# EAGLE design raspitreiber (EAGLE 9.6.2)
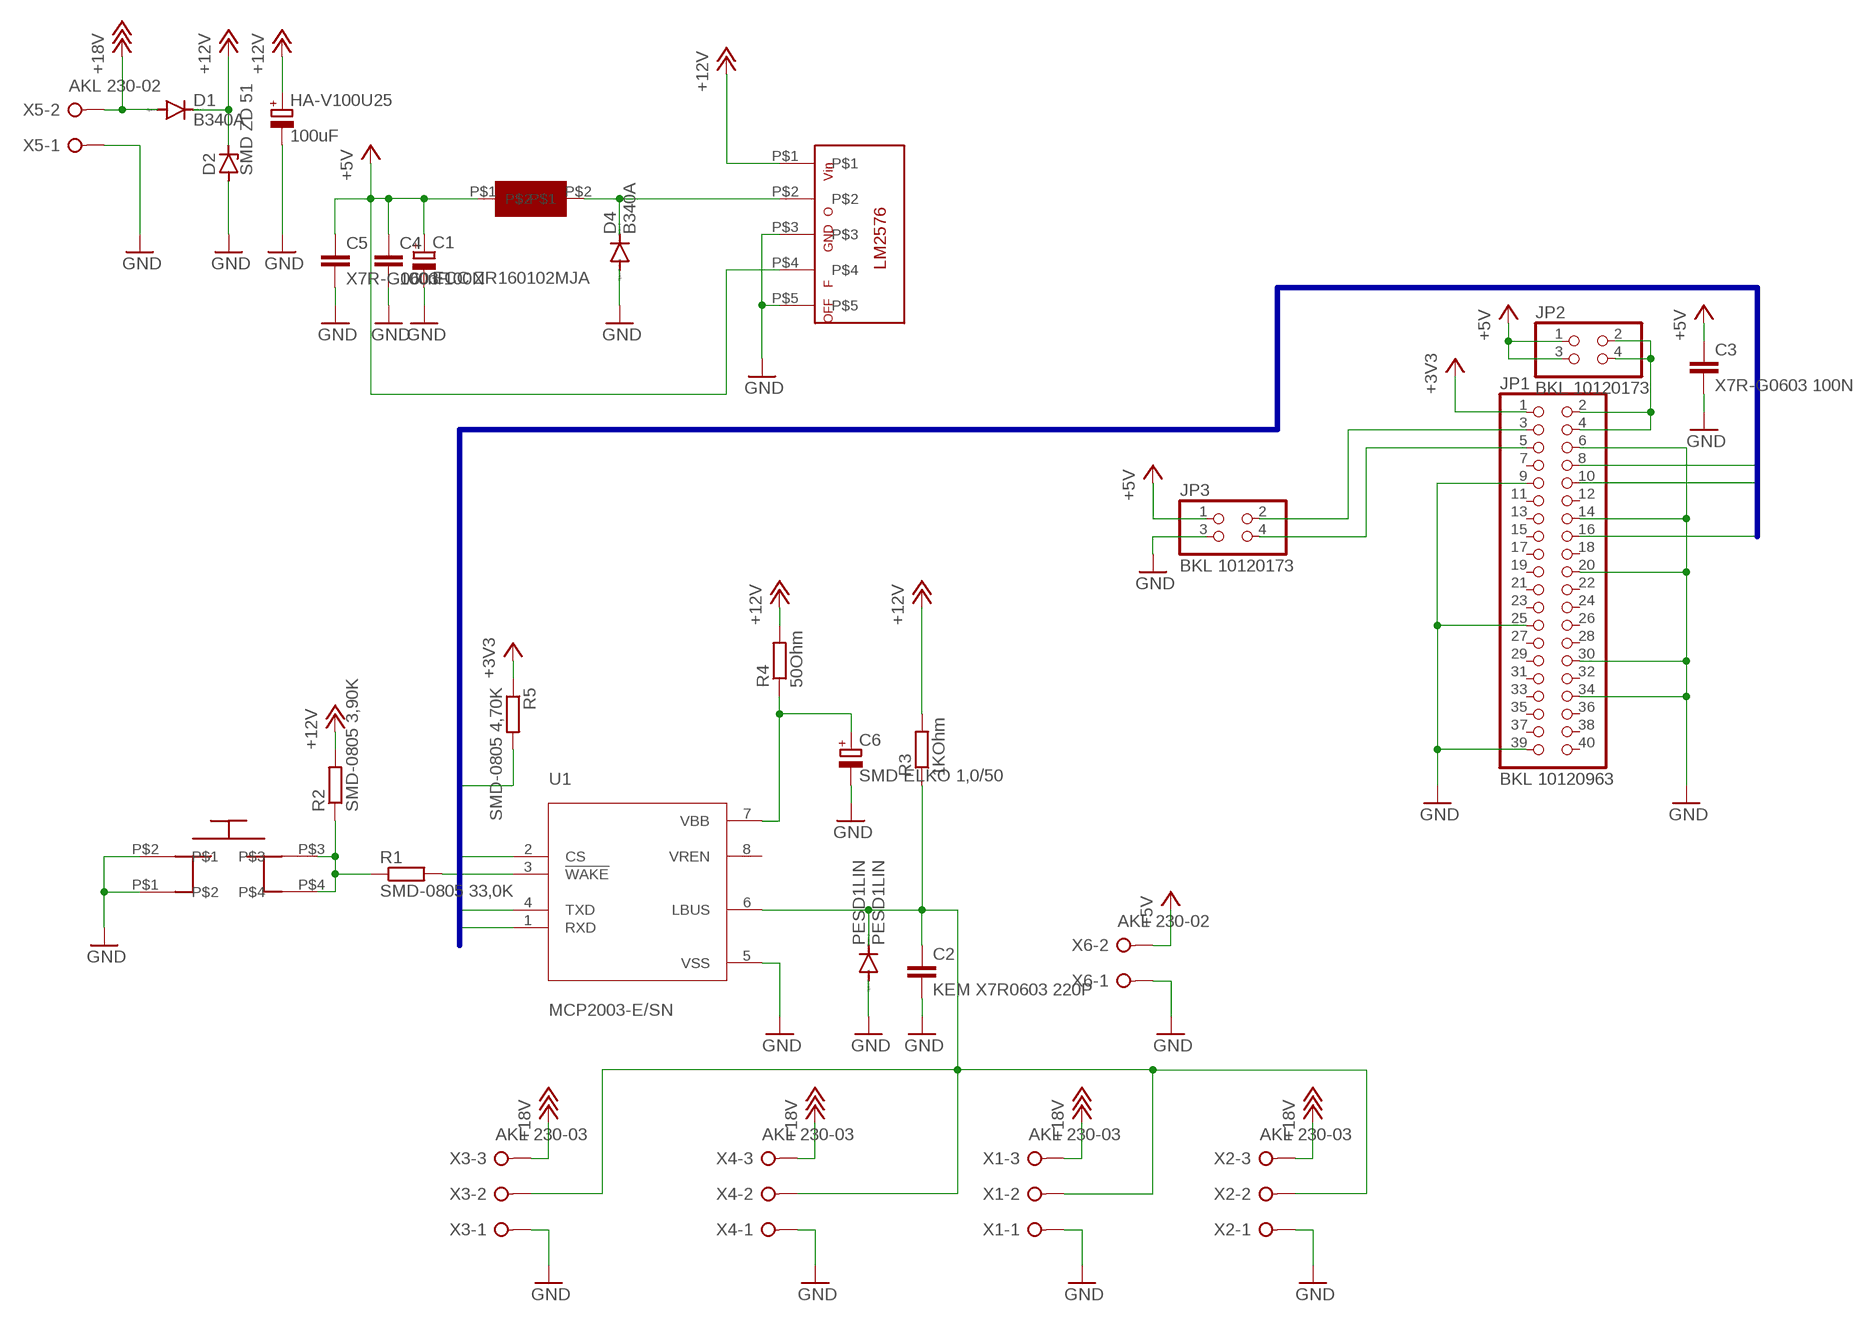
[diagram p0: schematic, sheet 1]

## Parts
C1  ECC ZR160102MJA  CPOL-EU153CLV-1012  [153CLV-1012]
C2  KEM X7R0603 220P  C-EUC0603  [C0603]
C3  X7R-G0603 100N  C-EUC0603  [C0603]
C4  100nF  C-EUC0603  [C0603]
C5  X7R-G0603 100N  C-EUC0603  [C0603]
C6  SMD ELKO 1,0/50  CPOL-EU150CLZ-0810  [150CLZ-0810]
D1  B340A  DIODE-SMC  [SMC]
D2  SMD ZD 51  ZENER-DIODESOT23  [SOT23]
D4  B340A  DIODE-SMC  [SMC]
HA-V100U25  100uF  CPOL-EU153CLV-0807  [153CLV-0807]
JP1  BKL 10120963  PINHD-2X20  [2X20]
JP2  BKL 10120173  PINHD-2X2  [2X02]
JP3  BKL 10120173  PINHD-2X2  [2X02]
L-09HVP100  LDEVICE7MM  [LFOOT7MM]
PESD1LIN  PESD1LIN  DIODE-SOD323-W  [SOD323-W]
R1  SMD-0805 33,0K  R-EU_M0805  [M0805]
R2  SMD-0805 3,90K  R-EU_M0805  [M0805]
R3  1KOhm  R-EU_M0805  [M0805]
R4  50Ohm  R-EU_M0805  [M0805]
R5  SMD-0805 4,70K  R-EU_M0805  [M0805]
TASTER9313  SCHALTDEV  [SCHALTFOOT]
U1  MCP2003-E/SN  [SOIC127P600X175-8N]
U$1  LM2576  [LM2576]
X1  AKL 230-03  W237-3E  [W237-3E]
X2  AKL 230-03  W237-3E  [W237-3E]
X3  AKL 230-03  W237-3E  [W237-3E]
X4  AKL 230-03  W237-3E  [W237-3E]
X5  AKL 230-02  W237-02P  [W237-132]
X6  AKL 230-02  W237-02P  [W237-132]

## Nets
+3V3: JP1.1 R5.1
+5V: C1.+ C3.1 C4.1 C5.1 JP2.1 JP2.3 JP3.1 L-09HVP100.P$1 U$1.P$4 X6.2
+12V: D1.C D2.3(C) HA-V100U25.+ R2.2 R3.2 R4.2 U$1.P$1
+18V: D1.A X1.3 X2.3 X3.3 X4.3 X5.2
CS: JP1.16 U1.2(CS)
GND: C1.- C2.2 C3.2 C4.2 C5.2 C6.- D2.1(A) D4.A HA-V100U25.- JP1.6 JP1.9 JP1.14 JP1.20 JP1.25 JP1.30 JP1.34 JP1.39 JP3.3 PESD1LIN.A TASTER9313.P$1 TASTER9313.P$2 U1.5(VSS) U$1.P$3 U$1.P$5 X1.1 X2.1 X3.1 X4.1 X5.1 X6.1
N$1: D4.C L-09HVP100.P$2 U$1.P$2
N$2: C6.+ R4.1 U1.7(VBB)
N$4: R1.1 R2.1 TASTER9313.P$3 TASTER9313.P$4
N$5: R1.2 U1.3(!WAKE)
N$7: C2.1 PESD1LIN.C R3.1 U1.6(LBUS) X1.2 X2.2 X3.2 X4.2
N$8: JP1.2 JP1.4 JP2.2 JP2.4
N$9: JP1.3 JP3.2
N$10: JP1.5 JP3.4
RX: JP1.10 R5.2 U1.1(RXD)
TX: JP1.8 U1.4(TXD)
Unconnected: JP1.7 JP1.11 JP1.12 JP1.13 JP1.15 JP1.17 JP1.18 JP1.19 JP1.21 JP1.22 JP1.23 JP1.24 JP1.26 JP1.27 JP1.28 JP1.29 JP1.31 JP1.32 JP1.33 JP1.35 JP1.36 JP1.37 JP1.38 JP1.40 U1.8(VREN)

## Buses
CS,RX,TX

## Library data of the parts
C1 C6 HA-V100U25 = rcl:CPOL-EU: POLARIZED CAPACITOR, European symbol; SPICEPREFIX: C
C2-C5 = rcl:C-EU: CAPACITOR, European symbol; SPICEPREFIX: C
D1 D4 PESD1LIN = diode:DIODE-: DIODE
D2 = diode:ZENER-DIODE: Z-Diode
JP1 = pinhead:PINHD-2X20: PIN HEADER
JP2 JP3 = pinhead:PINHD-2X2: PIN HEADER
L-09HVP100 = own:LDEVICE7MM
R1-R5 = rcl:R-EU_: RESISTOR, European symbol; SPICEPREFIX: R
TASTER9313 = own:SCHALTDEV
U1 = MCP2003-E_SN:MCP2003-E/SN: MCP2003 Series 6 to 27 V Bidirectional LIN J2602 Transceiver SMT - SOIC-8; A1_MIN: 0.1; A_MAX: 1.75; A_MIN: 1.75; A_NOM: 1.75; B_MAX: 0.51; B_MIN: 0.31; B_NOM: 0.41; D2_MAX: 0.0; D_MAX: 4.9; D_MIN: 4.9; D_NOM: 4.9; E1_MAX: 3.9; E1_MIN: 3.9; E1_NOM: 3.9; E2_MAX: 0.0; ENOM: 1.27; E_MAX: 6.0; E_MIN: 6.0; E_NOM: 6.0; L_MAX: 1.27; L_MIN: 0.4; L_NOM: 0.835; MANUFACTURER: Microchip; MAXIMUM_PACKAGE_HEIGHT: 1.75mm; PARTREV: G; PIN_COUNT: 8.0; STANDARD: IPC 7351B
U$1 = own:LM2576
X1-X4 = con-wago-508:W237-3E: WAGO SREW CLAMP; OC_FARNELL: unknown; OC_NEWARK: unknown
X5 X6 = con-wago-508:W237-02P: WAGO SREW CLAMP; OC_FARNELL: unknown; OC_NEWARK: unknown

## Board
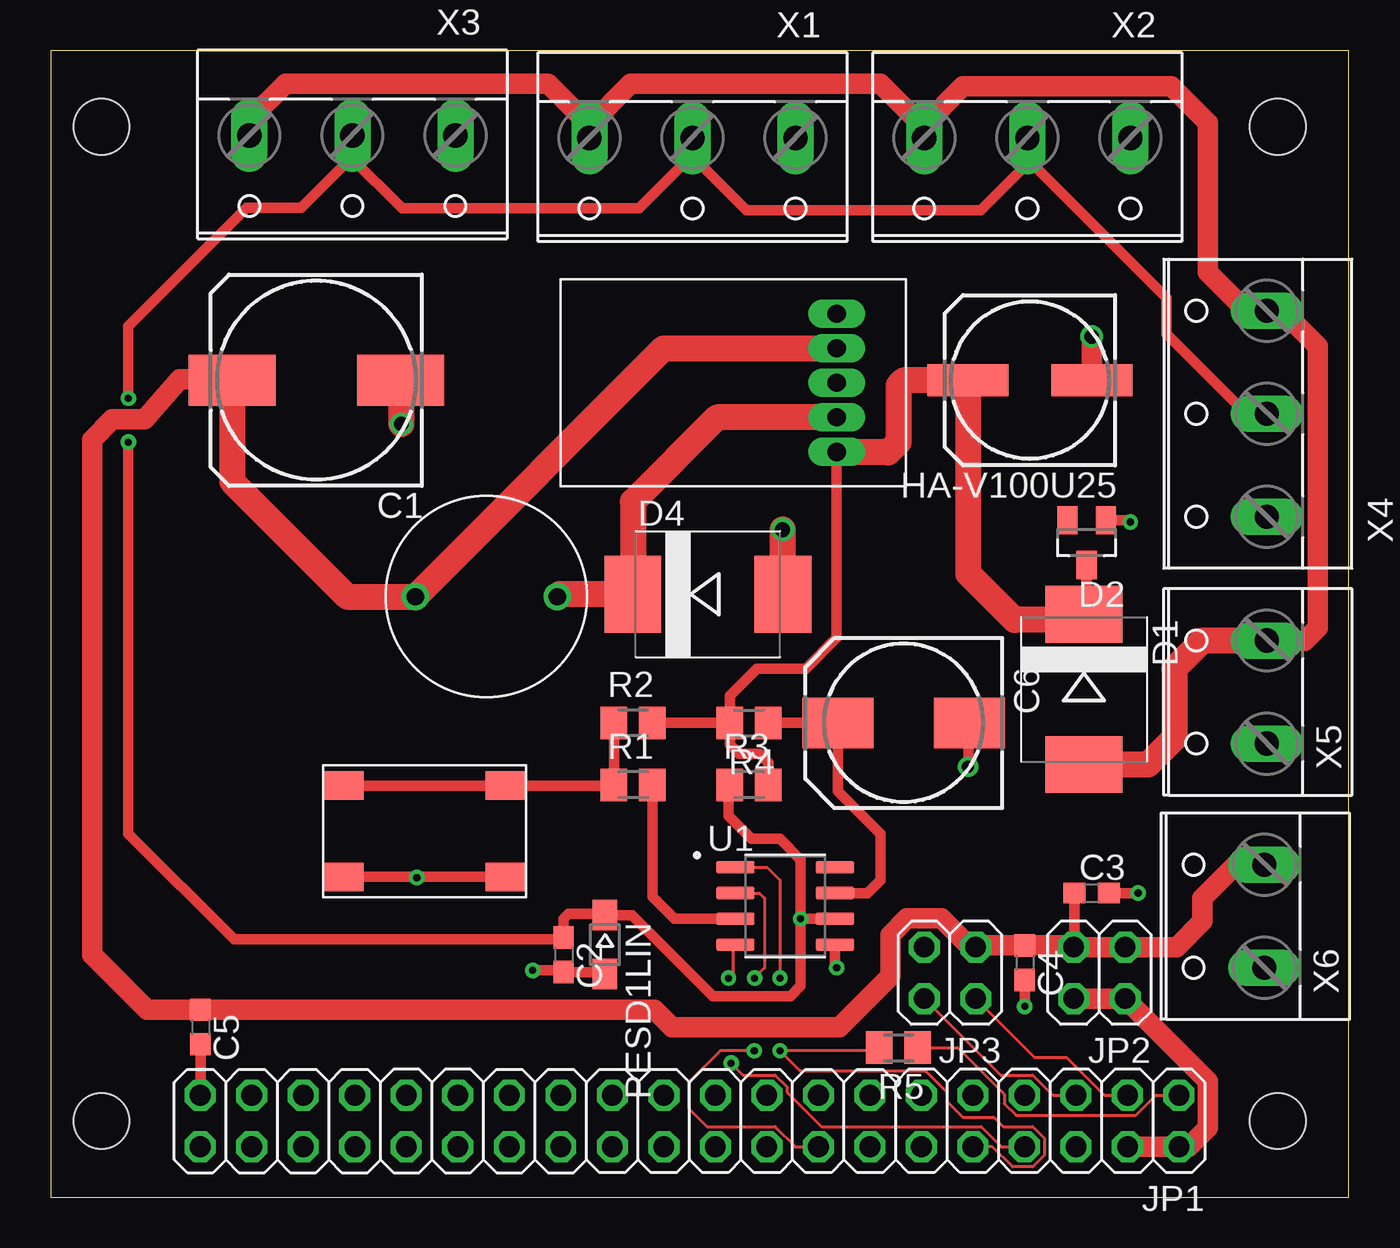
[diagram p1: board, top side]
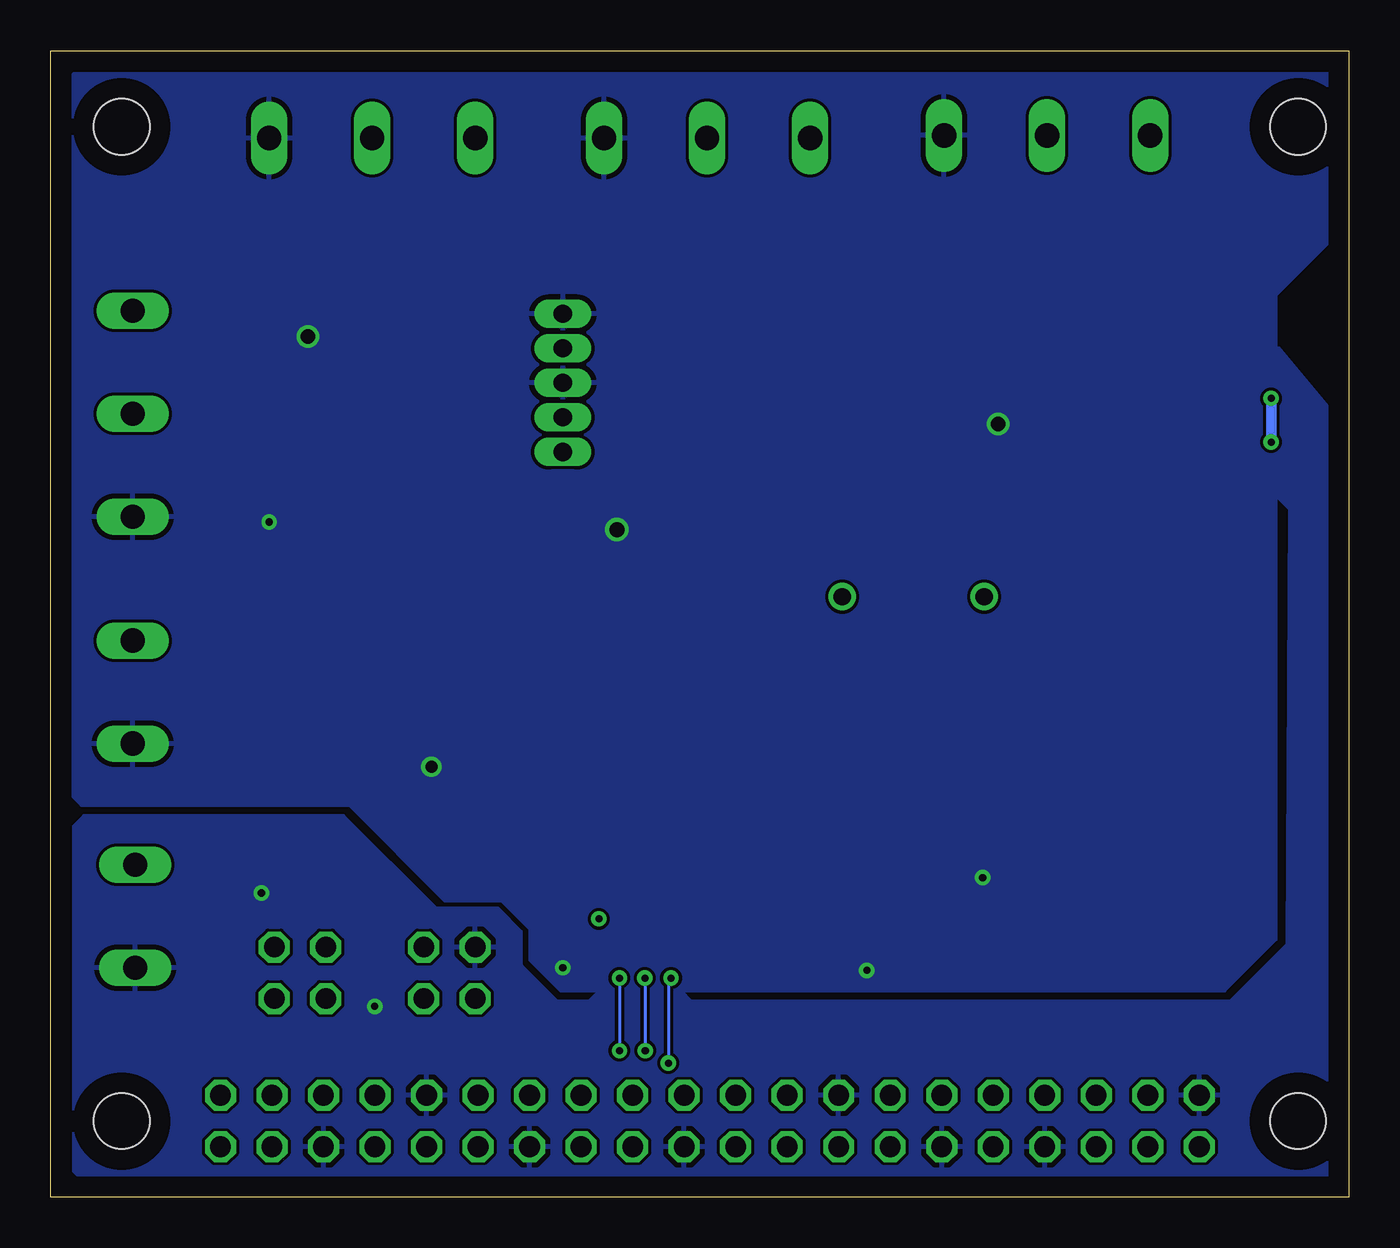
[diagram p2: board, bottom side, seen from below]

Size 64 x 56.5 mm. Coordinates in mm from the lower left corner, seen from the top.
Outline: 0,0 64,0 64,56.5 0,56.5 0,0
Copper layers (1*16): Top 0.035mm / dielectric 1.5mm / Bottom 0.035mm
Design rules "default": minimum track width 6mil, minimum drill 0.35mm, track to track 6mil, track to pad 6mil, pad to pad 6mil, via to via 6mil, smd to smd 6mil, copper to edge 40mil, drill to drill 6mil, minimum pad ring 10mil, minimum via ring 8mil, stop-mask expansion 4mil, vias tented up to drill 0mil, thermal gap 10mil
Holes 2.75 mm at 60.5,52.75 2.5,52.75 2.5,3.75 60.5,3.75

### Footprints (pad centres in the part's own frame; a part is rotated, then mirrored left to right if it is on the bottom)
153CLV-1012 = smd 4.3 x 2.5: + 4.15,0; - -4.15,0
C0603 = smd 1.1 x 1: 1 -0.85,0; 2 0.85,0
150CLZ-0810 = smd 3.5 x 2.5: + 3.25,0; - -3.25,0
SMC = smd 2.8 x 3.8: A 3.7,0; C -3.7,0
SOT23 = smd 1 x 1.4: 1 -0.95,-1.1; 2 0.95,-1.1; 3 0,1.1
153CLV-0807 = smd 4 x 1.6: + 3.05,0; - -3.05,0
2X20 = drill 1.016 octagon: 1 -24.13,-1.27; 2 -24.13,1.27; 3 -21.59,-1.27; 4 -21.59,1.27; 5 -19.05,-1.27; 6 -19.05,1.27; 7 -16.51,-1.27; 8 -16.51,1.27; 9 -13.97,-1.27; 10 -13.97,1.27; 11 -11.43,-1.27; 12 -11.43,1.27; 13 -8.89,-1.27; 14 -8.89,1.27; 15 -6.35,-1.27; 16 -6.35,1.27; 17 -3.81,-1.27; 18 -3.81,1.27; 19 -1.27,-1.27; 20 -1.27,1.27; 21 1.27,-1.27; 22 1.27,1.27; 23 3.81,-1.27; 24 3.81,1.27; 25 6.35,-1.27; 26 6.35,1.27; 27 8.89,-1.27; 28 8.89,1.27; 29 11.43,-1.27; 30 11.43,1.27; 31 13.97,-1.27; 32 13.97,1.27; 33 16.51,-1.27; 34 16.51,1.27; 35 19.05,-1.27; 36 19.05,1.27; 37 21.59,-1.27; 38 21.59,1.27; 39 24.13,-1.27; 40 24.13,1.27
2X02 = drill 1.016 octagon: 1 -1.27,-1.27; 2 -1.27,1.27; 3 1.27,-1.27; 4 1.27,1.27
LFOOT7MM = drill 0.85: P$1 -3.5,0; P$2 3.5,0
SOD323-W = smd 1.5 x 1.2: A 1.45,0; C -1.45,0
M0805 = smd 1.3 x 1.6: 1 -0.95,0; 2 0.95,0
SCHALTFOOT = smd 2 x 1.4: P$1 4,2.25; P$2 -4,2.25; P$3 -4,-2.25; P$4 4,-2.25
SOIC127P600X175-8N = smd 1.9 x 0.6: 1 -2.455,1.905; 2 -2.455,0.635; 3 -2.455,-0.635; 4 -2.455,-1.905; 5 2.455,-1.905; 6 2.455,-0.635; 7 2.455,0.635; 8 2.455,1.905
LM2576 = drill 0.9 long: P$1 3.404,0; P$2 1.702,0; P$3 0,0; P$4 -1.702,0; P$5 -3.404,0
W237-3E = drill 1.194 long: 1 -5.08,-0.635; 2 0,-0.635; 3 5.08,-0.635
W237-132 = drill 1.194 long: 1 -2.54,-0.635; 2 2.54,-0.635

### Placement (x,y rotation side)
C1  13.1,40.26 180 top
C2  25.29,11.94 270 top
C3  51.32,14.99 0 top
C4  48.02,11.56 270 top
C5  7.38,8.38 270 top
C6  42.05,23.37 180 top
D1  50.94,25.02 270 top
D2  51.07,32.26 180 top
D4  32.4,29.72 0 top
HA-V100U25  48.28,40.26 180 top
JP1  31.5,3.75 180 top
JP2  51.7,11.05 180 top
JP3  44.34,11.05 180 top
L-09HVP100  21.48,29.59 0 top
PESD1LIN  27.32,12.45 270 top
R1  28.72,20.32 0 top
R2  28.72,23.37 0 top
R3  34.43,20.32 0 top
R4  34.43,23.37 180 top
R5  41.8,7.37 180 top
TASTER9313  18.43,18.03 180 top
U1  36.21,14.35 0 top
U$1  38.75,40.13 270 top
X1  31.64,51.56 180 top
X2  48.15,51.56 180 top
X3  14.88,51.69 180 top
X4  59.33,38.61 90 top
X5  59.33,24.89 90 top
X6  59.2,13.84 90 top

### Tracks (layer width: path | path; a pad name or v marks a point on that pad's centre or on a via)
+3V3
  Top 0.152: R5.1 44.72,7.37 47.02,5.07 47.02,4.61 47.6,4.03 53.5,4.03 54.49,5.02 JP1.1
+5V
  Top 0.508: C3.1 50.47,12.36 JP2.3
  Top 1.016: C1.+ 8.91,40.3 6.35,40.3 4.64,38.33 3.04,38.33 2.05,37.34 2.05,11.94 4.75,9.23 C5.1 29.77,9.23 30.62,8.38 38.88,8.38 41.39,10.9 41.39,12.91 42.23,13.74 43.91,13.74 45.34,12.32 JP3.1 45.7,12.41 C4.1 50.35,12.41 JP2.3 JP2.1 55.52,12.32 56.78,13.59 56.78,14.73 58.44,16.38 X6.2
  Top 1.27: C1.+ 8.95,35.27 14.62,29.59 L-09HVP100.P$1 30.22,41.83 U$1.P$4
+12V
  Top 0.508: R4.2 R2.2 | R4.2 33.48,24.7 34.81,26.04 37.23,26.04 38.75,27.56 38.75,36.68 38.78,36.7 | R4.2 33.48,22.29 33.92,21.84 34.94,21.84 35.38,21.4 R3.2 | D2.3 51.07,28.85 D1.C
  Top 1.27: U$1.P$1 38.78,36.7 41.29,36.7 41.8,37.21 41.8,40.01 42.05,40.26 HA-V100U25.+ 45.23,30.74 47.51,28.45 50.67,28.45 D1.C
+18V
  Top 1.016: X5.2 61.84,27.43 62.48,28.07 62.48,41.93 60.72,43.69 X4.3 58.94,43.69 57.04,45.59 57.04,52.96 55.26,54.74 44.97,54.74 43.07,52.83 X2.3 43.07,52.7 40.91,54.86 28.59,54.86 26.56,52.83 | 26.56,52.83 X1.3 | 26.56,52.83 24.53,54.86 11.57,54.86 9.79,53.09 X3.3
  Top 1.27: X5.2 56.78,27.43 55.39,26.04 55.39,22.61 54.1,21.32 D1.A
CS  (via drill 0.35)
  Top 0.152: v34.71,10.79 34.69,10.79 35.2,11.3 35.2,14.73 34.94,14.99 U1.2 | v34.69,7.22 33.01,7.22 31.45,5.65 31.45,4.38 32.36,3.47 35.72,3.47 36.71,2.48 JP1.16
  Bottom 0.152: v34.71,10.79 34.71,10.54 34.69,10.52 v34.69,7.22
GND  (via drill 0.35, 0.6, 0.7, 0.75)
  Top 0.508: D2.1 53.15,33.36 v53.23,33.27 | v23.77,11.18 25.2,11.18 C2.2 27.23,11.09 PESD1LIN.A | U1.5 38.67,11.39 v38.75,11.3 | C4.2 v48.02,9.4 | C5.2 7.38,5.03 JP1.39 | 18.09,15.78 v18.05,15.75 | TASTER9313.P$2 18.09,15.78 | C6.- 45.3,23.12 v45.23,21.21 | TASTER9313.P$1 18.09,15.78 | C3.2 v53.61,14.99
  Top 1.016: HA-V100U25.- v51.33,42.42 v51.32,42.42
  Top 1.27: C1.- 17.29,40.22 v17.29,38.1 | D4.A 36.1,32.88 v36.08,32.89
  pour Bottom: 0.4,55.88 62.37,55.88 63.39,54.86 63.39,20.19 62.5,19.3 49.29,19.3 44.59,14.61 41.8,14.61 40.4,13.21 40.4,11.68 38.88,10.16 6.11,10.16 3.57,12.7 3.57,44.45 0.14,47.88 0.14,55.63
  pour Bottom: 0.14,37.9 3.47,41.89 4.71,40.64 4.71,35.69 2.94,33.91 3.05,12.46 5.86,9.65 32.4,9.65 32.91,10.16 36.97,10.16 37.48,9.65 39.01,9.65 40.78,11.43 40.78,13.08 41.93,14.22 44.97,14.22 49.55,18.8 62.37,18.8 62.88,18.29 62.88,1.27 62.37,0.76 1.03,0.76 0.14,1.65
N$1
  Top 1.27: U$1.P$2 32.86,38.43 28.7,34.27 D4.C 25.11,29.72 L-09HVP100.P$2
N$2
  Top 0.508: U1.7 40.27,14.99 40.91,15.62 40.91,17.91 38.8,20.01 C6.+ R4.1
N$4
  Top 0.508: TASTER9313.P$4 TASTER9313.P$3 27.73,20.28 R1.1 R2.1
N$5
  Top 0.508: U1.3 30.75,13.72 29.67,14.8 R1.2
N$7  (via drill 0.35)
  Top 0.508: v3.83,37.21 3.83,17.91 9.03,12.7 25.2,12.7 C2.1 25.29,13.72 25.54,13.97 27.25,13.97 PESD1LIN.C 28.66,13.9 32.66,9.91 36.47,9.91 36.97,10.41 v36.97,13.72 | v3.83,39.37 3.83,42.93 9.67,48.77 12.34,48.77 14.88,51.31 X3.2 14.75,52.2 14.75,51.31 17.33,48.73 29,48.73 31.64,51.37 X1.2 31.64,51.31 34.31,48.64 45.86,48.64 48.15,50.93 X2.2 48.15,51.18 55.01,44.32 55.01,42.55 58.94,38.61 X4.2 | v36.97,13.72 36.97,16.64 35.96,17.65 34.56,17.65 33.42,18.8 33.42,20.25 R3.1 | v36.97,13.72 U1.6
  Bottom 0.508: v3.83,39.37 v3.83,37.21
N$8
  Top 1.016: JP2.4 JP2.2 57.05,5.7 57.05,3.42 56.12,2.48 JP1.2 JP1.4
N$9
  Top 0.152: JP3.2 48.5,6.89 50.09,6.89 51.95,5.02 JP1.3
N$10
  Top 0.152: JP3.4 46.84,6.01 48.42,6.01 49.41,5.02 JP1.5
RX  (via drill 0.35)
  Top 0.152: U1.1 35.32,16.26 35.96,15.62 v35.96,10.79 | JP1.10 46.44,2.48 47.43,1.49 48.42,1.49 49,2.07 49,2.89 48.42,3.47 46.96,3.47 46.5,3.94 44.97,3.94 44.17,4.74 44.17,5.18 43.15,6.2 36.97,6.2 v35.96,7.22 40.7,7.22 R5.2
  Bottom 0.152: v35.96,10.79 v35.96,7.22
TX  (via drill 0.35)
  Top 0.152: U1.4 33.63,12.32 33.63,11.01 v33.42,10.79 | v33.54,6.6 34.14,6.01 35.72,6.01 36.3,5.43 36.3,5.17 38,3.47 45.88,3.47 46.87,2.48 JP1.8
  Bottom 0.152: v33.42,10.79 33.54,10.79 v33.54,6.6